# Altium project Ferrofluid_Display.PrjPcb
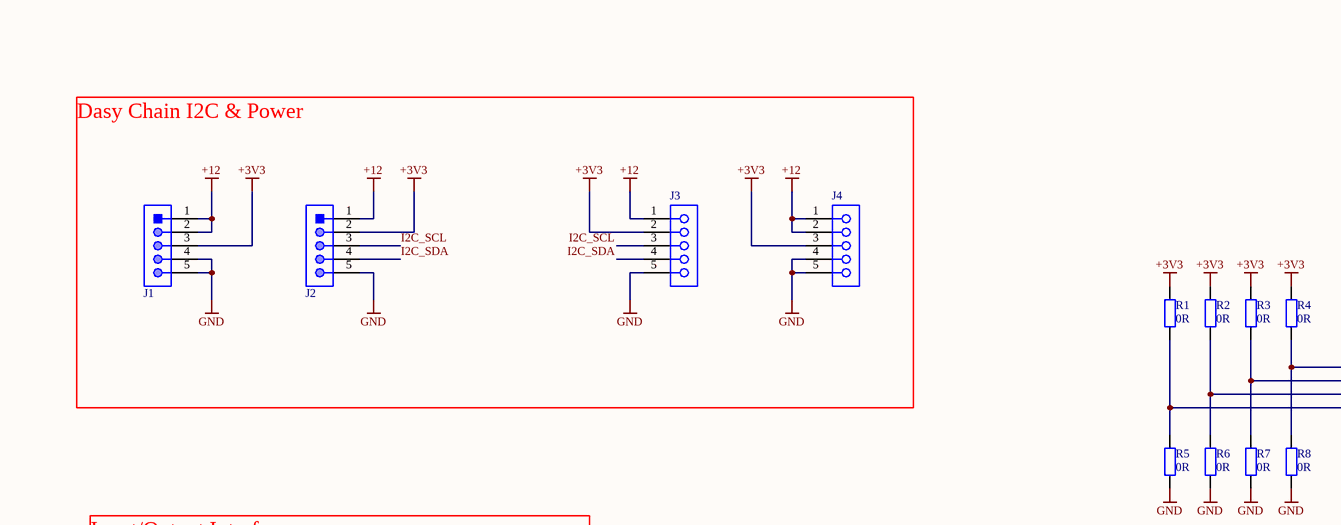
[diagram p0: Ferrofluid_Display.SchDoc, top left]
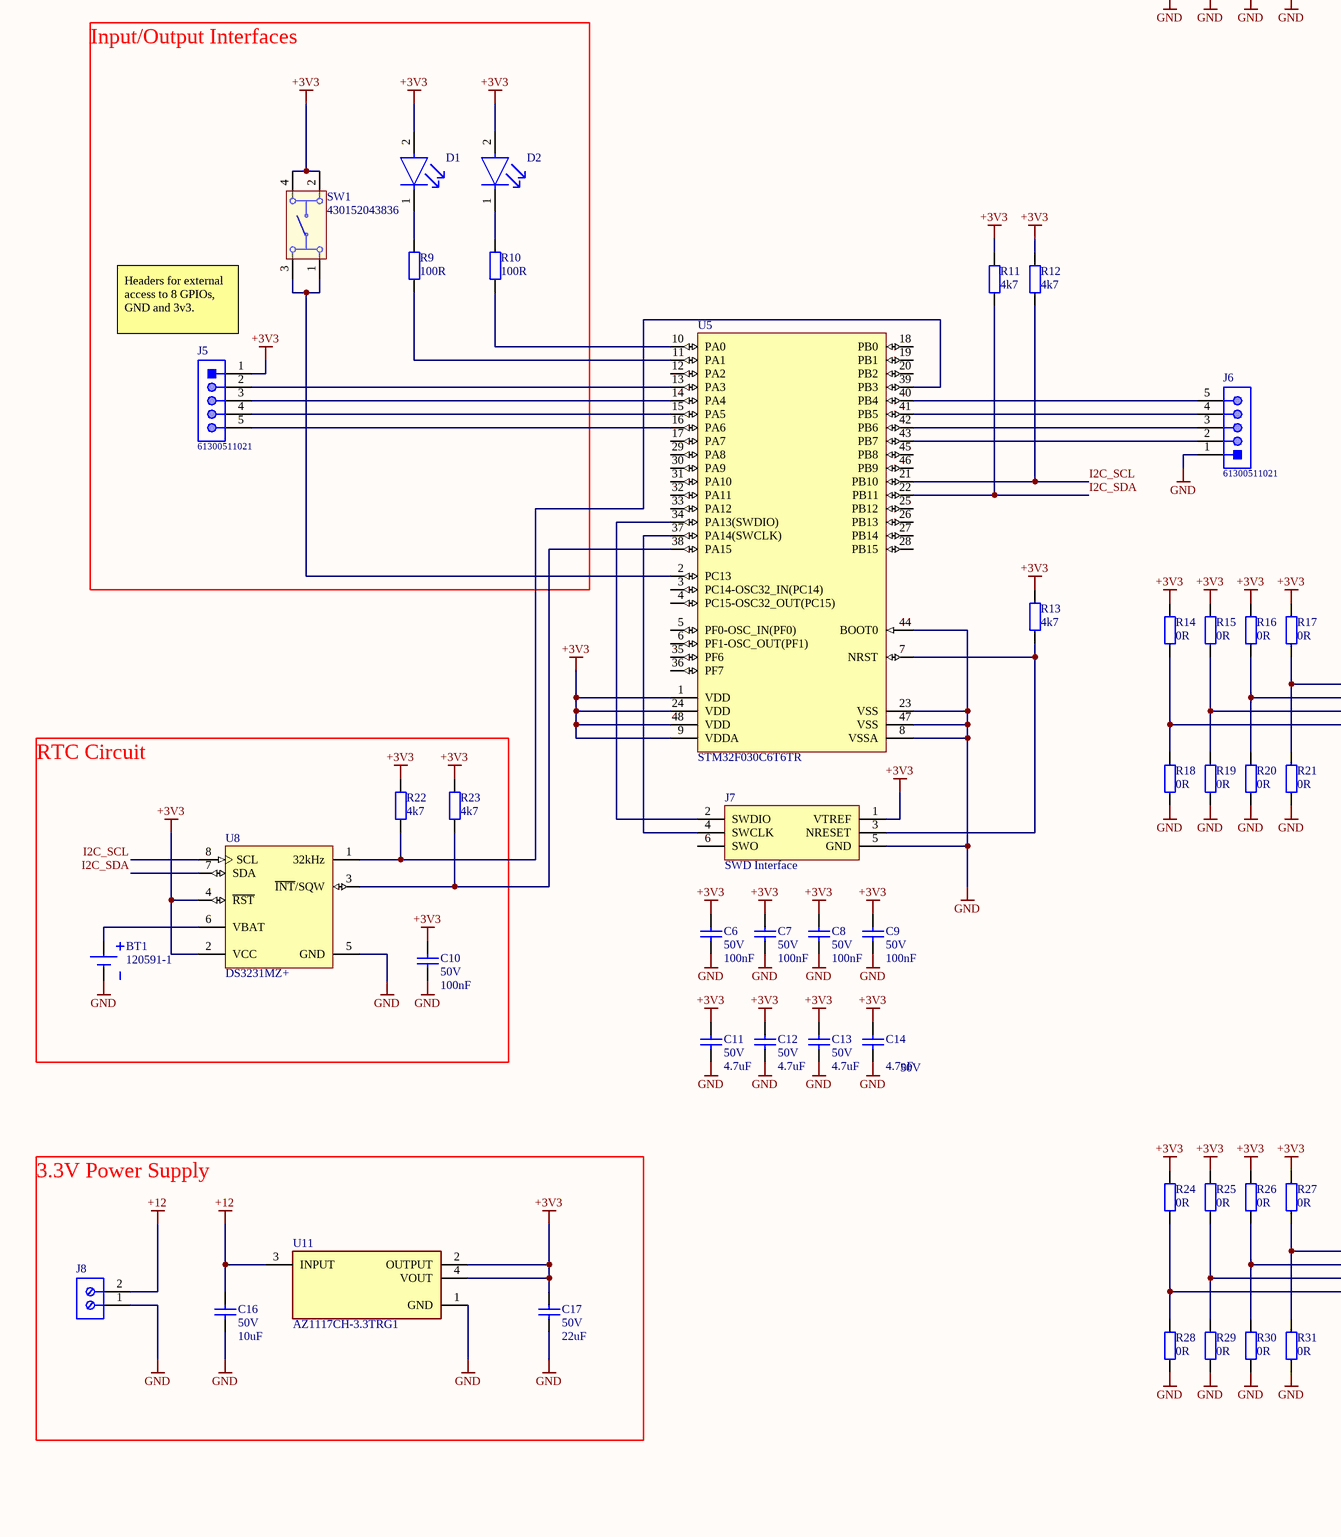
[diagram p1: Ferrofluid_Display.SchDoc, bottom left]
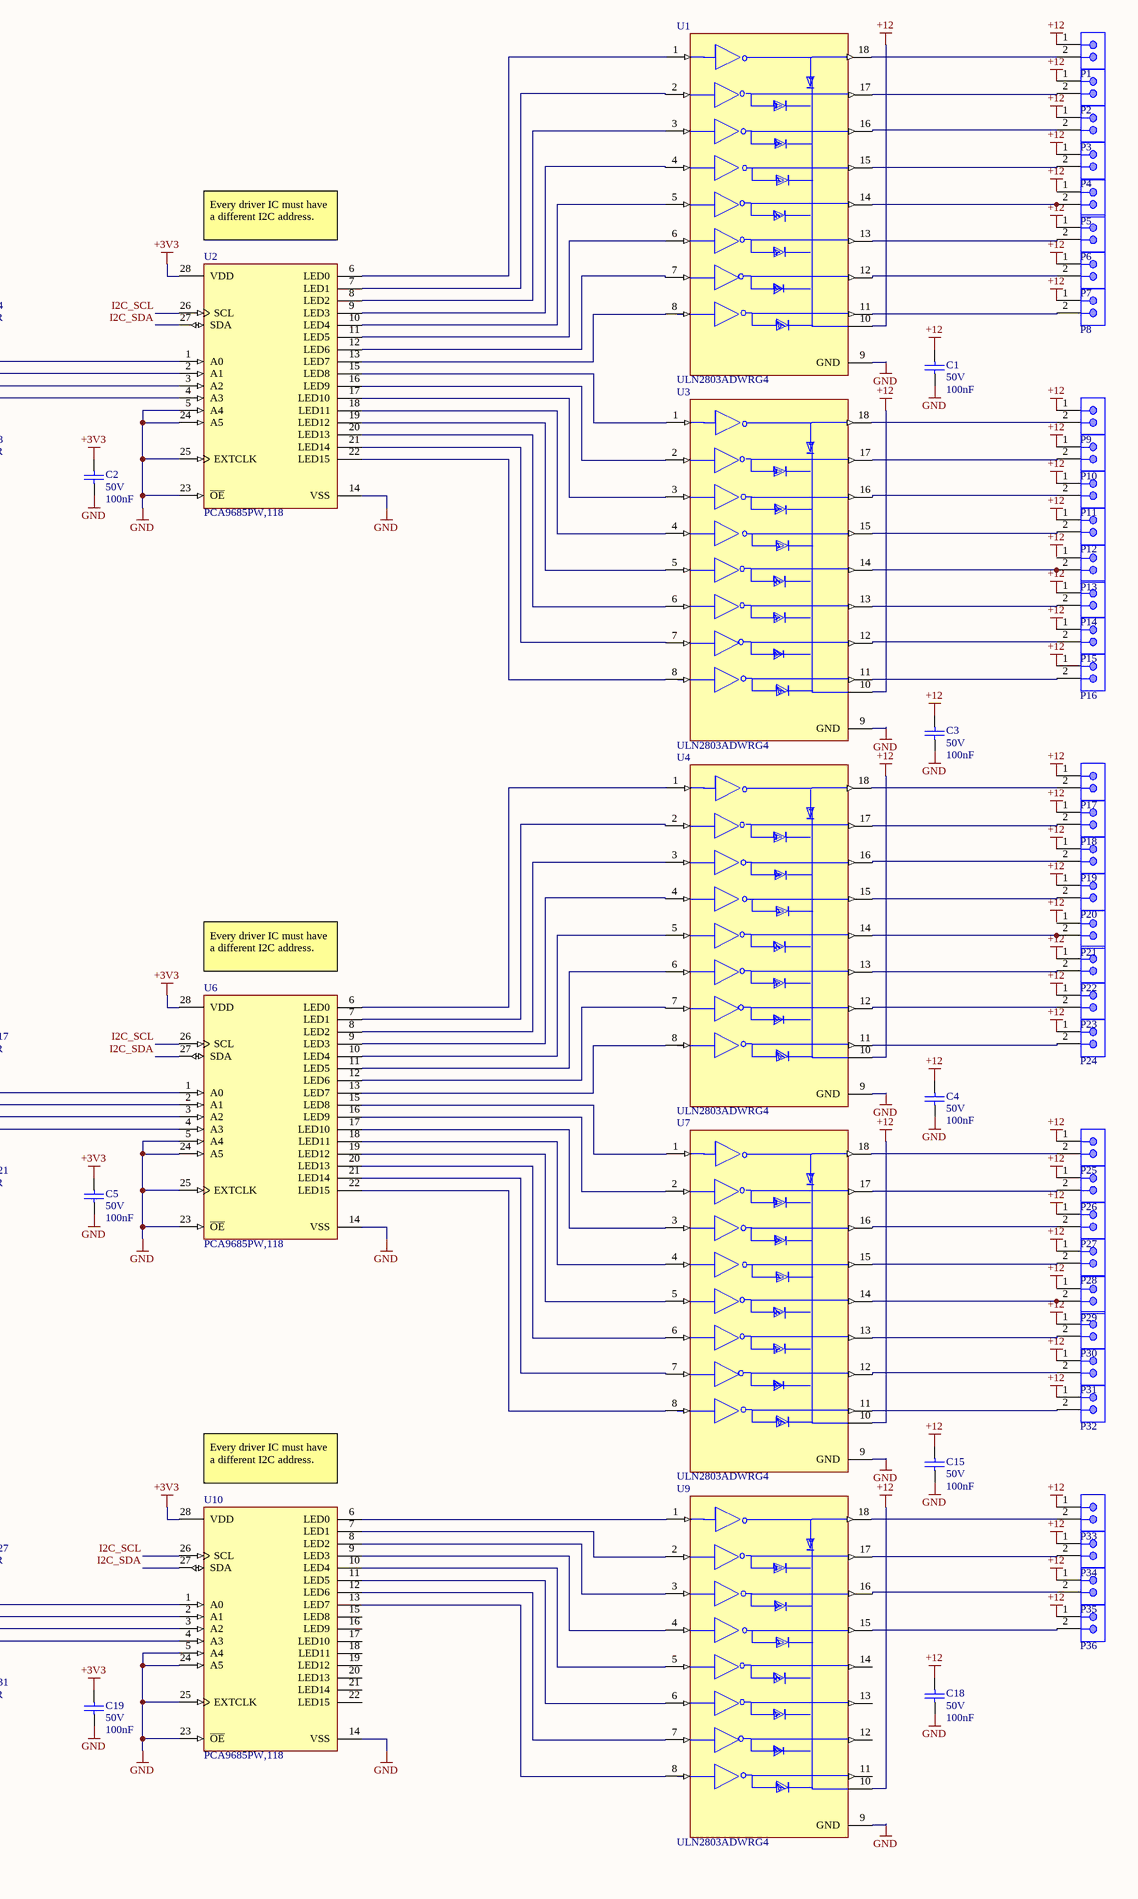
[diagram p2: Ferrofluid_Display.SchDoc, bottom right]
1 sheet, 109 parts. Net scope: global (net labels, ports and power ports of the same name join across sheets).
Board file: Ferrofluid_Display.PcbDoc

## Sheet Ferrofluid_Display.SchDoc
size A2

### Parts
BT1  120591-1  [TECO-120591-1-2_V]
C1  value 100nF  Voltage Rating: 50V  [CAPC2013X88X50ML20T25]  (hidden comment: Cap_0805)
C2  value 100nF  Voltage Rating: 50V  [CAPC2013X88X50ML20T25]  (hidden comment: Cap_0805)
C3  value 100nF  Voltage Rating: 50V  [CAPC2013X88X50ML20T25]  (hidden comment: Cap_0805)
C4  value 100nF  Voltage Rating: 50V  [CAPC2013X88X50ML20T25]  (hidden comment: Cap_0805)
C5  value 100nF  Voltage Rating: 50V  [CAPC2013X88X50ML20T25]  (hidden comment: Cap_0805)
C6  value 100nF  Voltage Rating: 50V  [CAPC2013X88X50ML20T25]  (hidden comment: Cap_0805)
C7  value 100nF  Voltage Rating: 50V  [CAPC2013X88X50ML20T25]  (hidden comment: Cap_0805)
C8  value 100nF  Voltage Rating: 50V  [CAPC2013X88X50ML20T25]  (hidden comment: Cap_0805)
C9  value 100nF  Voltage Rating: 50V  [CAPC2013X88X50ML20T25]  (hidden comment: Cap_0805)
C10  value 100nF  Voltage Rating: 50V  [CAPC2013X88X50ML20T25]  (hidden comment: Cap_0805)
C11  value 4.7uF  Voltage Rating: 50V  [CAPC2013X88X50ML20T25]  (hidden comment: Cap_0805)
C12  value 4.7uF  Voltage Rating: 50V  [CAPC2013X88X50ML20T25]  (hidden comment: Cap_0805)
C13  value 4.7uF  Voltage Rating: 50V  [CAPC2013X88X50ML20T25]  (hidden comment: Cap_0805)
C14  value 4.7uF  Voltage Rating: 50V  [CAPC2013X88X50ML20T25]  (hidden comment: Cap_0805)
C15  value 100nF  Voltage Rating: 50V  [CAPC2013X88X50ML20T25]  (hidden comment: Cap_0805)
C16  value 10uF  Voltage Rating: 50V  [CAPC2013X88X50ML20T25]  (hidden comment: Cap_0805)
C17  value 22uF  Voltage Rating: 50V  [CAPC2013X88X50ML20T25]  (hidden comment: Cap_0805)
C18  value 100nF  Voltage Rating: 50V  [CAPC2013X88X50ML20T25]  (hidden comment: Cap_0805)
C19  value 100nF  Voltage Rating: 50V  [CAPC2013X88X50ML20T25]  (hidden comment: Cap_0805)
D1  LTST-C150AKT  [FP-LTST-C150AKT-MFG]  (value not drawn)
D2  LTST-C150AKT  [FP-LTST-C150AKT-MFG]  (value not drawn)
J1  61300511021  [61300511021]  (value not drawn)
J2  61300511021  [61300511021]  (value not drawn)
J3  SSQ-105-02-T-S-RA  [SMTC-SSQ-105-02-X-S-RA]  (value not drawn)
J4  SSQ-105-02-T-S-RA  [SMTC-SSQ-105-02-X-S-RA]  (value not drawn)
J5  61300511021  [61300511021]
J6  61300511021  [61300511021]
J7  SWD Interface  [J-Link_6-pin_Needle_Adapter]
J8  691102710002  [691102710002]  (value not drawn)
P1  5-146280-2  [ELECTROMAGNET]  (value not drawn)
P2  5-146280-2  [ELECTROMAGNET]  (value not drawn)
P3  5-146280-2  [ELECTROMAGNET]  (value not drawn)
P4  5-146280-2  [ELECTROMAGNET]  (value not drawn)
P5  5-146280-2  [ELECTROMAGNET]  (value not drawn)
P6  5-146280-2  [ELECTROMAGNET]  (value not drawn)
P7  5-146280-2  [ELECTROMAGNET]  (value not drawn)
P8  5-146280-2  [ELECTROMAGNET]  (value not drawn)
P9  5-146280-2  [ELECTROMAGNET]  (value not drawn)
P10  5-146280-2  [ELECTROMAGNET]  (value not drawn)
P11  5-146280-2  [ELECTROMAGNET]  (value not drawn)
P12  5-146280-2  [ELECTROMAGNET]  (value not drawn)
P13  5-146280-2  [ELECTROMAGNET]  (value not drawn)
P14  5-146280-2  [ELECTROMAGNET]  (value not drawn)
P15  5-146280-2  [ELECTROMAGNET]  (value not drawn)
P16  5-146280-2  [ELECTROMAGNET]  (value not drawn)
P17  5-146280-2  [ELECTROMAGNET]  (value not drawn)
P18  5-146280-2  [ELECTROMAGNET]  (value not drawn)
P19  5-146280-2  [ELECTROMAGNET]  (value not drawn)
P20  5-146280-2  [ELECTROMAGNET]  (value not drawn)
P21  5-146280-2  [ELECTROMAGNET]  (value not drawn)
P22  5-146280-2  [ELECTROMAGNET]  (value not drawn)
P23  5-146280-2  [ELECTROMAGNET]  (value not drawn)
P24  5-146280-2  [ELECTROMAGNET]  (value not drawn)
P25  5-146280-2  [ELECTROMAGNET]  (value not drawn)
P26  5-146280-2  [ELECTROMAGNET]  (value not drawn)
P27  5-146280-2  [ELECTROMAGNET]  (value not drawn)
P28  5-146280-2  [ELECTROMAGNET]  (value not drawn)
P29  5-146280-2  [ELECTROMAGNET]  (value not drawn)
P30  5-146280-2  [ELECTROMAGNET]  (value not drawn)
P31  5-146280-2  [ELECTROMAGNET]  (value not drawn)
P32  5-146280-2  [ELECTROMAGNET]  (value not drawn)
P33  5-146280-2  [ELECTROMAGNET]  (value not drawn)
P34  5-146280-2  [ELECTROMAGNET]  (value not drawn)
P35  5-146280-2  [ELECTROMAGNET]  (value not drawn)
P36  5-146280-2  [ELECTROMAGNET]  (value not drawn)
R1  value 0R  [RESC2013X50X30ML20T20]  (hidden comment: Res_0805)
R2  value 0R  [RESC2013X50X30ML20T20]  (hidden comment: Res_0805)
R3  value 0R  [RESC2013X50X30ML20T20]  (hidden comment: Res_0805)
R4  value 0R  [RESC2013X50X30ML20T20]  (hidden comment: Res_0805)
R5  value 0R  [RESC2013X50X30ML20T20]  (hidden comment: Res_0805)
R6  value 0R  [RESC2013X50X30ML20T20]  (hidden comment: Res_0805)
R7  value 0R  [RESC2013X50X30ML20T20]  (hidden comment: Res_0805)
R8  value 0R  [RESC2013X50X30ML20T20]  (hidden comment: Res_0805)
R9  value 100R  [RESC2013X50X30ML20T20]  (hidden comment: Res_0805)
R10  value 100R  [RESC2013X50X30ML20T20]  (hidden comment: Res_0805)
R11  value 4k7  [RESC2013X50X30ML20T20]  (hidden comment: Res_0805)
R12  value 4k7  [RESC2013X50X30ML20T20]  (hidden comment: Res_0805)
R13  value 4k7  [RESC2013X50X30ML20T20]  (hidden comment: Res_0805)
R14  value 0R  [RESC2013X50X30ML20T20]  (hidden comment: Res_0805)
R15  value 0R  [RESC2013X50X30ML20T20]  (hidden comment: Res_0805)
R16  value 0R  [RESC2013X50X30ML20T20]  (hidden comment: Res_0805)
R17  value 0R  [RESC2013X50X30ML20T20]  (hidden comment: Res_0805)
R18  value 0R  [RESC2013X50X30ML20T20]  (hidden comment: Res_0805)
R19  value 0R  [RESC2013X50X30ML20T20]  (hidden comment: Res_0805)
R20  value 0R  [RESC2013X50X30ML20T20]  (hidden comment: Res_0805)
R21  value 0R  [RESC2013X50X30ML20T20]  (hidden comment: Res_0805)
R22  value 4k7  [RESC2013X50X30ML20T20]  (hidden comment: Res_0805)
R23  value 4k7  [RESC2013X50X30ML20T20]  (hidden comment: Res_0805)
R24  value 0R  [RESC2013X50X30ML20T20]  (hidden comment: Res_0805)
R25  value 0R  [RESC2013X50X30ML20T20]  (hidden comment: Res_0805)
R26  value 0R  [RESC2013X50X30ML20T20]  (hidden comment: Res_0805)
R27  value 0R  [RESC2013X50X30ML20T20]  (hidden comment: Res_0805)
R28  value 0R  [RESC2013X50X30ML20T20]  (hidden comment: Res_0805)
R29  value 0R  [RESC2013X50X30ML20T20]  (hidden comment: Res_0805)
R30  value 0R  [RESC2013X50X30ML20T20]  (hidden comment: Res_0805)
R31  value 0R  [RESC2013X50X30ML20T20]  (hidden comment: Res_0805)
SW1  430152043836  [430152043836]
U1  ULN2803ADWRG4  [FP-DW0018A-MFG]
U2  PCA9685PW,118  [FP-SOT361-1-MFG]
U3  ULN2803ADWRG4  [FP-DW0018A-MFG]
U4  ULN2803ADWRG4  [FP-DW0018A-MFG]
U5  STM32F030C6T6TR  [STM-LQFP48_M]
U6  PCA9685PW,118  [FP-SOT361-1-MFG]
U7  ULN2803ADWRG4  [FP-DW0018A-MFG]
U8  DS3231MZ+  [S8MK+1_N]
U9  ULN2803ADWRG4  [FP-DW0018A-MFG]
U10  PCA9685PW,118  [FP-SOT361-1-MFG]
U11  AZ1117CH-3.3TRG1  [FP-SOT223-MFG]

### Nets
+3V3: C2.2 C5.2 C6.2 C7.2 C8.2 C9.2 C10.2 C11.2 C12.2 C13.2 C14.2 C17.2 C19.2 D1.2(A) D2.2(A) J1.3 J2.2 J3.2 J4.3 J5.1 J7.1(VTREF) R1.2 R2.2 R3.2 R4.2 R11.2 R12.2 R13.2 R14.2 R15.2 R16.2 R17.2 R22.2 R23.2 R24.2 R25.2 R26.2 R27.2 SW1.2 SW1.4 U2.28(VDD) U5.1(VDD) U5.9(VDDA) U5.24(VDD) U5.48(VDD) U6.28(VDD) U8.2(VCC) U8.4(~{RST}) U10.28(VDD) U11.2(OUTPUT) U11.4(VOUT)
+12: C1.2 C3.2 C4.2 C15.2 C16.2 C18.2 J1.1 J1.2 J2.1 J3.1 J4.1 J4.2 J8.2 P1.1 P2.1 P3.1 P4.1 P6.1 P7.1 P8.1 P9.1 P10.1 P11.1 P12.1 P14.1 P15.1 P16.1 P17.1 P18.1 P19.1 P20.1 P22.1 P23.1 P24.1 P25.1 P26.1 P27.1 P28.1 P30.1 P31.1 P32.1 P33.1 P34.1 P35.1 P36.1 U1.10(COM) U3.10(COM) U4.10(COM) U7.10(COM) U9.10(COM) U11.3(INPUT)
GND: BT1.2(-) C1.1 C2.1 C3.1 C4.1 C5.1 C6.1 C7.1 C8.1 C9.1 C10.1 C11.1 C12.1 C13.1 C14.1 C15.1 C16.1 C17.1 C18.1 C19.1 J1.4 J1.5 J2.5 J3.5 J4.4 J4.5 J6.1 J7.5(GND) J8.1 R5.1 R6.1 R7.1 R8.1 R18.1 R19.1 R20.1 R21.1 R28.1 R29.1 R30.1 R31.1 U1.9(GND) U2.5(A4) U2.14(VSS) U2.23(~{OE}) U2.24(A5) U2.25(EXTCLK) U3.9(GND) U4.9(GND) U5.8(VSSA) U5.23(VSS) U5.44(BOOT0) U5.47(VSS) U6.5(A4) U6.14(VSS) U6.23(~{OE}) U6.24(A5) U6.25(EXTCLK) U7.9(GND) U8.5(GND) U9.9(GND) U10.5(A4) U10.14(VSS) U10.23(~{OE}) U10.24(A5) U10.25(EXTCLK) U11.1(GND)
I2C_SCL: J2.3 J3.3 R12.1 U2.26(SCL) U5.21(PB10) U6.26(SCL) U8.8(SCL) U10.26(SCL)
I2C_SDA: J2.4 J3.4 R11.1 U2.27(SDA) U5.22(PB11) U6.27(SDA) U8.7(SDA) U10.27(SDA)
NetBT1_1: BT1.1(+) U8.6(VBAT)
NetD1_1: D1.1(C) R9.2
NetD2_1: D2.1(C) R10.2
NetJ5_2: J5.2 U5.13(PA3)
NetJ5_3: J5.3 U5.14(PA4)
NetJ5_4: J5.4 U5.15(PA5)
NetJ5_5: J5.5 U5.16(PA6)
NetJ6_2: J6.2 U5.43(PB7)
NetJ6_3: J6.3 U5.42(PB6)
NetJ6_4: J6.4 U5.41(PB5)
NetJ6_5: J6.5 U5.40(PB4)
NetJ7_2: J7.2(SWDIO) U5.34(PA13(SWDIO))
NetJ7_3: J7.3(NRESET) R13.1 U5.7(NRST)
NetJ7_4: J7.4(SWCLK) U5.37(PA14(SWCLK))
NetP1_2: P1.2 U1.18(1C)
NetP2_2: P2.2 U1.17(2C)
NetP3_2: P3.2 U1.16(3C)
NetP4_2: P4.2 U1.15(4C)
NetP5_2: P5.2 U1.14(5C)
NetP6_2: P6.2 U1.13(6C)
NetP7_2: P7.2 U1.12(7C)
NetP8_2: P8.2 U1.11(8C)
NetP9_2: P9.2 U3.18(1C)
NetP10_2: P10.2 U3.17(2C)
NetP11_2: P11.2 U3.16(3C)
NetP12_2: P12.2 U3.15(4C)
NetP13_2: P13.2 U3.14(5C)
NetP14_2: P14.2 U3.13(6C)
NetP15_2: P15.2 U3.12(7C)
NetP16_2: P16.2 U3.11(8C)
NetP17_2: P17.2 U4.18(1C)
NetP18_2: P18.2 U4.17(2C)
NetP19_2: P19.2 U4.16(3C)
NetP20_2: P20.2 U4.15(4C)
NetP21_2: P21.2 U4.14(5C)
NetP22_2: P22.2 U4.13(6C)
NetP23_2: P23.2 U4.12(7C)
NetP24_2: P24.2 U4.11(8C)
NetP25_2: P25.2 U7.18(1C)
NetP26_2: P26.2 U7.17(2C)
NetP27_2: P27.2 U7.16(3C)
NetP28_2: P28.2 U7.15(4C)
NetP29_2: P29.2 U7.14(5C)
NetP30_2: P30.2 U7.13(6C)
NetP31_2: P31.2 U7.12(7C)
NetP32_2: P32.2 U7.11(8C)
NetP33_2: P33.2 U9.18(1C)
NetP34_2: P34.2 U9.17(2C)
NetP35_2: P35.2 U9.16(3C)
NetP36_2: P36.2 U9.15(4C)
NetR1_1: R1.1 R5.2 U2.4(A3)
NetR2_1: R2.1 R6.2 U2.3(A2)
NetR3_1: R3.1 R7.2 U2.2(A1)
NetR4_1: R4.1 R8.2 U2.1(A0)
NetR9_1: R9.1 U5.11(PA1)
NetR10_1: R10.1 U5.10(PA0)
NetR14_1: R14.1 R18.2 U6.4(A3)
NetR15_1: R15.1 R19.2 U6.3(A2)
NetR16_1: R16.1 R20.2 U6.2(A1)
NetR17_1: R17.1 R21.2 U6.1(A0)
NetR22_1: R22.1 U5.39(PB3) U8.1(32kHz)
NetR23_1: R23.1 U5.38(PA15) U8.3(~{INT}/SQW)
NetR24_1: R24.1 R28.2 U10.4(A3)
NetR25_1: R25.1 R29.2 U10.3(A2)
NetR26_1: R26.1 R30.2 U10.2(A1)
NetR27_1: R27.1 R31.2 U10.1(A0)
NetSW1_1: SW1.1 SW1.3 U5.2(PC13)
NetU1_1: U1.1(1B) U2.6(LED0)
NetU1_2: U1.2(2B) U2.7(LED1)
NetU1_3: U1.3(3B) U2.8(LED2)
NetU1_4: U1.4(4B) U2.9(LED3)
NetU1_5: U1.5(5B) U2.10(LED4)
NetU1_6: U1.6(6B) U2.11(LED5)
NetU1_7: U1.7(7B) U2.12(LED6)
NetU1_8: U1.8(8B) U2.13(LED7)
NetU2_15: U2.15(LED8) U3.1(1B)
NetU2_16: U2.16(LED9) U3.2(2B)
NetU2_17: U2.17(LED10) U3.3(3B)
NetU2_18: U2.18(LED11) U3.4(4B)
NetU2_19: U2.19(LED12) U3.5(5B)
NetU2_20: U2.20(LED13) U3.6(6B)
NetU2_21: U2.21(LED14) U3.7(7B)
NetU2_22: U2.22(LED15) U3.8(8B)
NetU4_1: U4.1(1B) U6.6(LED0)
NetU4_2: U4.2(2B) U6.7(LED1)
NetU4_3: U4.3(3B) U6.8(LED2)
NetU4_4: U4.4(4B) U6.9(LED3)
NetU4_5: U4.5(5B) U6.10(LED4)
NetU4_6: U4.6(6B) U6.11(LED5)
NetU4_7: U4.7(7B) U6.12(LED6)
NetU4_8: U4.8(8B) U6.13(LED7)
NetU6_15: U6.15(LED8) U7.1(1B)
NetU6_16: U6.16(LED9) U7.2(2B)
NetU6_17: U6.17(LED10) U7.3(3B)
NetU6_18: U6.18(LED11) U7.4(4B)
NetU6_19: U6.19(LED12) U7.5(5B)
NetU6_20: U6.20(LED13) U7.6(6B)
NetU6_21: U6.21(LED14) U7.7(7B)
NetU6_22: U6.22(LED15) U7.8(8B)
NetU9_1: U9.1(1B) U10.6(LED0)
NetU9_2: U9.2(2B) U10.7(LED1)
NetU9_3: U9.3(3B) U10.8(LED2)
NetU9_4: U9.4(4B) U10.9(LED3)
NetU9_5: U9.5(5B) U10.10(LED4)
NetU9_6: U9.6(6B) U10.11(LED5)
NetU9_7: U9.7(7B) U10.12(LED6)
NetU9_8: U9.8(8B) U10.13(LED7)

Not connected (* = marked no-connect by the designer): J7 6(SWO); P5 1; P13 1; P21 1; P29 1; U5 3(PC14-OSC32_IN(PC14)) 4(PC15-OSC32_OUT(PC15)) 5(PF0-OSC_IN(PF0)) 6(PF1-OSC_OUT(PF1)) 12(PA2) 17(PA7) 18(PB0) 19(PB1) 20(PB2) 25(PB12) 26(PB13) 27(PB14) 28(PB15) 29(PA8) 30(PA9) 31(PA10) 32(PA11) 33(PA12) 35(PF6) 36(PF7) 45(PB8) 46(PB9); U9 11(8C) 12(7C) 13(6C) 14(5C); U10 15(LED8) 16(LED9) 17(LED10) 18(LED11) 19(LED12) 20(LED13) 21(LED14) 22(LED15)

### Notes on the sheet
- (near U2) Every driver IC must have a different I2C address.
- Dasy Chain I2C & Power
- Headers for external access to 8 GPIOs, GND and 3v3.
- Input/Output Interfaces
- (near U6) Every driver IC must have a different I2C address.
- RTC Circuit
- (near U10) Every driver IC must have a different I2C address.
- 3.3V Power Supply
- Labels drawn without touching a wire or pin: +12
- Artikelname:
- Biral AG
- CH 3110 Münsingen
- Format:
- Artikelnummer:
- Gezeichnet:
- Geprüft:
- Blatt:
- A2
- of
- Zeichnungsnummer:
- Index:

### Library data of the parts
BT1 = CMP-0438-00001-2: Lithium Battery Holder for CR2032 3V Cell; Manufacturer: TE Connectivity; Packing Type: Tray; Body Shape: Horizontal Cylindrical; AccessRights: 2147483647; RevisionId: 1; Folder: Unified Components\Components\TE Connectivity\Connectors & Connector Components\Power Products\Battery Interconnection Products\; ContentType: Unified Component; ContentTypeGUID: CB3C11C4-E317-11DF-B822-12313F0024A2; ComponentLink1Description: Manufacturer URL; LifeCycleStateGUID: 61E382EE-6656-4F12-9E24-BE9327104A25; FolderGUID: A6761B51-D489-48A3-9180-F4808F45AB79; PartNumber: 120591-1; LifeCycle: Released; ReleaseDate: 20/08/2013 02:50:22 AM; PackageReference: 120591-1; ComponentLink2URL: http://www.te.com/commerce/DocumentDelivery/DDEController?Action=showdoc&DocId=Customer+Drawing%7F120591%7FH%7Fpdf%7FEnglish%7FENG_CD_120591_H.pdf%7F120591-1; DatasheetVersion: Rev. H, 01/2013; PackageDescription: Lithium Battery Holder; ItemGUID: B2C50140-681E-4F62-8DBB-9728605318CE; ItemHRID: CMP-0438-00001; Mounting Technology: Through Hole; ComponentLink1URL: http://www.te.com/; ComponentLink2Description: Datasheet
C1-C19 = Cap_0805: Ceramic Capacitor X7R
D1 D2 = CMP-22017-000004-1: LED AMBER CLEAR SMD; Manufacturer: Lite-On; Luminous Intensity: 6mcd; Viewing Angle: 130°; Wavelength: 602nm; Reverse Voltage: 5V; Forward Current: 30mA; Led Orientation: Top View; Power Dissipation: 100mW; Peak Emmision Wavelength: 610nm; Forward Voltage: 2.1V; ComponentLink2Description: Datasheet; Device Class L3: unset; Height: 1.2mm; RoHS: TRUE; ComponentLink2URL: https://media.digikey.com/pdf/Data%20Sheets/Lite-On%20PDFs/LTST-C150AKT.pdf; Temperature: -55°C to +85°C; Package: 0; Automotive: No; Manufacturer Part Number: LTST-C150AKT; Temperature Range Low: -55°C; Device Class L2: LEDs; Device Class L1: Optoelectronics; Octopart: https://octopart.com/ltst-c150akt-lite-on-549804; Digikey Description: LED AMBER CLEAR SMD; Colour: Amber; Category: Diode; Mouser Description: Standard LEDs - SMD Amber Clear 602nm; Lead Free: Yes; Temperature Range High: +85°C
J1 J2 J5 J6 = CMP-1502-01067-1: THT Angled Pin Header WR-PHD, Pitch 2.54 mm, Single Row, 5 pins; Manufacturer: Wurth Elektronik; Working Voltage: 250VAC; Withstanding Voltage: 500VAC; Gender: Male; Contact Resistance: 20mOhm; Rated Current: 3A; Pitch: 2.54mm; Pin Number: 5; Orientation: Angled; Packaging: Bag; Package Reference: 61300511021; Mounting Technology: THT; Publisher: WurthElektronik; Row Number: Single; Operating Temperature: -40to105degC; Part Number: 61300511021; Datasheet URL: https://katalog.we-online.de/em/datasheet/6130xx11021.pdf; Manufacturer URL: http://www.we-online.de
J3 J4 = CMP-1023-00281-1: SQ Post Socket, Through-hole, Right Angle, -55 to 105 degC, 2.54 mm Pitch, 5-Pin, Female, RoHS; Manufacturer: Samtec; Pitch: 2.54 mm; ComponentLink1URL: http://www.samtec.com; ComponentLink2Description: Datasheet; ComponentLink3URL: http://www.samtec.com/documents/webfiles/cpdf/SSQ-1XX-XX-XXX-X-XX-XXX-XX-X-MKT.pdf; DatasheetVersion: F-214; ComponentLink1Description: Manufacturer URL; Mounting Technology: Through-hole; ComponentLink2URL: http://www.samtec.com/documents/webfiles/pdf/SSQ_TH.PDF; PackageVersion: BD, 6/1987; ComponentLink3Description: Package Specification; RoHS: True; PackageReference: SSQ-105-02-X-S-RA; Orientation: Right Angle; PartNumber: SSQ-105-02-T-S-RA; Temperature Range: -55 to 105 degC; PackageDescription: Assembly, Socket Strip .025[0.64] SQ Tail
J7 = J-Link_6-pin_Needle_Adapter: J-Link 6-pin Needle Adapter
J8 = CMP-1502-03258-1: Series 102 - 5.00 mm Horizontal Entry Modular with Pressure Clamp WR-TBL, 2 pin; Manufacturer: Wurth Elektronik; Pin Number: 2; Pitch: 5.00mm; Manufacturer URL: http://www.we-online.de; Mounting Technology: THT; Publisher: WurthElektronik; Packaging: Box; Package Reference: 691102710002; Datasheet URL: http://katalog.we-online.de/em/datasheet/6911027100xx.pdf; Operating Temperature: -40to105degC; Part Number: 691102710002
P1-P36 = Magnet: Male Header, Pitch 2.54 mm, 1 x 2 Position, Height 8.21 mm, Tail Length 3.05 mm, -65 to 105 degC, RoHS, Bulk; Manufacturer: TE Connectivity; Mating Connector Lock: No(Without); Number of Positions: 2; Pitch: 2.54mm; PCB Mounting Orientation: Vertical; Keyed: No; Case\/Package: 100; Mating Post Length: 0.23inch; High Temperature Housing: Yes; Max Current Rating: 5A; PCB Thickness: 0.063inch; PCB Mount Retention: Without; Approvals: CSA; Current Rating: 3A; Radiation Hardening: No; Length: 4.67mm; Contact Mating Length: 0.23inch; Connector Type: Header; Number of Rows: 1; Termination Post Length: 0.12inch; Board Standoff: No(Without); Max Operating Temperature: 105degC; Contact Shape: Square; Selectively Loaded: No(Without); Gasket: No(Without); Number of Contacts: 2; Contact Gender: Male; Mating Alignment: No(Without); Manufacturer URL: http://www.te.com/; Datasheet URL: http://www.te.com/commerce/DocumentDelivery/DDEController?Action=showdoc&DocId=Customer+Drawing%7F146280%7FH1%7Fpdf%7FEnglish%7FENG_CD_146280_H1.pdf%7F5-146280-2; Mount: ThroughHole; Orientation: Straight; Packaging: Carton; Package Reference: 5-146280-2; Package Quantity: 500; Stabilizers: No(Without); Row Spacing: 2.54mm; Contact Material: CopperAlloy; Panel Mount Retention: No(Without); Datasheet Version: Rev. H1, 08/2016; Housing Colour: Black; Colour: Black; Package Description: Male Header, Pitch 2.54 mm, 1 x 2 Position, Height 8.21 mm, Tail Length 3.05 mm; Contact Plating: Matte; Housing Material: Polymer; Contact Protection: No(Without); Min Operating Temperature: -65degC; Mounting Technology: ThroughHole; Flammability Rating: UL94V-0; RoHSCompliant: true; Termination: ThroughHole; Depth: 2.34mm; High Speed Serial Data Connector: No
R1-R31 = Res_0805: Resistor; Tolerance: 1%; Power Rating: 125mW
SW1 = CMP-1452-00002-1: WS-TASV SMD Tact Switch 6X6 mm; Manufacturer: Wuerth Elektronik; NoPins: 04; PartNumber: 430152043836; ComponentLink2URL: http://katalog.we-online.de/em/datasheet/4301x2.pdf; ComponentLink1URL: http://www.we-online.com; ComponentLink2Description: Datasheet; ComponentLink1Description: Manufacturer URL; PackageReference: 430152043836
U1 U3 U4 U7 U9 = CMP-04912-000023-1: TRANS 8NPN DARL 50V 0.5A 18SO; Manufacturer: Texas Instruments; Number Of Drivers: 8; Max Junction Temp: +150°C; Standoff Height: 0.1mm; Turn On Delay Time: 20ns; Nominal Supply Current: 0.93mA; Turn Off Delay Time: 130ns; Output Current: 500mA; Manufacturer Part Number: ULN2803ADWRG4; Mouser Description: Darlington Transistors TRANSISTOR ARRAYS; Temperature Range High: +85°C; Ipc Land Pattern Name: SOIC127P1030X265-18; RoHS: TRUE; ComponentLink2URL: http://www.ti.com/lit/ds/symlink/uln2803a.pdf; Device Class L2: Power Management ICs; Output Voltage: 50V; Digikey Description: TRANS 8NPN DARL 50V 0.5A 18SO; Package: DW0018A; Device Class L3: Gate Drivers; Octopart: https://octopart.com/uln2803adwrg4-texas+instruments-2343640; ComponentLink2Description: Datasheet; Ambient Temperature Range High: +85°C; Lead Free: Yes; Device Class L1: Integrated Circuits (ICs); Height: 2.65mm; Category: IC; Automotive: No; Temperature: -40°C to +85°C; Temperature Range Low: -40°C; Ambient Temperature Range Low: -40°C; Number Of Outputs: 8
U2 U6 U10 = CMP-10140-000001-1: IC LED DRIVER RGBA 28-TSSOP; Manufacturer: NXP Semiconductors; Max Power Dissipation: 400mW; Dimming: I2C,PWM; Number Of Outputs: 16; Import Ts: 1521846855; Min Supply Voltage: 2.3V; Max Supply Voltage: 5.5V; Output Voltage: 5V; Nominal Supply Current: 6mA; Standoff Height: 0.05mm; Output Current: 25mA; Ciiva Ids: 1426473; Temperature Range Low: -40°C; Footprint Url: https://www.nxp.com/docs/en/package-information/SOT361-1.pdf; Height: 1.1mm; Manufacturer Part Number: PCA9685PW,118; Device Class L2: Power Management ICs; Temperature: -40°C to +85°C; Temperature Range High: +85°C; Digikey Description: IC LED DRIVER RGBA 28-TSSOP; ComponentLink2Description: Datasheet; Device Class L3: LED Drivers; Ambient Temperature Range Low: -40°C; ComponentLink2URL: https://www.nxp.com/docs/en/data-sheet/PCA9685.pdf; Ambient Temperature Range High: +85°C; Device Class L1: Integrated Circuits (ICs); Mouser Description: LED Display Drivers I2C Bus LED Controller 28-Pin; Octopart: https://octopart.com/pca9685pw%2C118-nxp+semiconductors-11853435; Release Date: 1454319143; Lead Free: Yes; Category: IC; RoHS: TRUE; Package: SOT361-1; Automotive: No
U5 = CMP-0304-00063-2: ARM Cortex-M0 32-bit MCU, 32 KB Flash, 4 KB Internal RAM, 39 I/Os, 48-Pin LQFP, -40 to 85 degC, Tape and Reel; Manufacturer: STMicroelectronics; I/Os (High Current): 39; FLASH Size (Prog) (kB): 32; Operating Frequency(F) (Processor speed) (MHz): 48; Supply Voltage(Vcc) min (V): 2.4; Internal RAM Size (kB): 4; Package Description: 48-Pin Low Profile Quad Flat Package, Body 7 x 7 mm, Pitch 0.5 mm; DatasheetVersion: Rev. 2; ComponentLink1URL: http://www.st.com/; ComponentLink2URL: http://www.st.com/st-web-ui/static/active/en/resource/technical/document/datasheet/DM00088500.pdf; Mounting Technology: Surface Mount; Core: ARM Cortex-M0; Package Reference: LQFP48; Packing: Tape and Reel; PartNumber: STM32F030C6T6TR; ComponentLink2Description: Datasheet; ComponentLink1Description: Manufacturer URL
U8 = CMP-0254-00001-2: +/-5ppm, MEMS based Real-Time Clock, I2C Interface, 8-Pin SO, -40 to 85 degC, Pb-Free; PackageVersion: revC, 2010; ComponentLink3Description: Package Specification; ComponentLink3URL: http://pdfserv.maxim-ic.com/package_dwgs/21-0041.PDF; PackageReference: S8MK+1; DatasheetVersion: Rev 3, Dec-2011; ComponentLink1Description: Manufacturer URL; ComponentLink2Description: Datasheet; PackageDescription: 8-Pin Small-Outline IC, Narrow (0.15in), 1.27 mm Pitch, SOIC (N), Pb-Free; Code_IPC: SOIC127P600-8; ComponentLink1URL: http://www.maxim-ic.com; Code_JEDEC: MS-012-AA; ComponentLink2URL: http://datasheets.maxim-ic.com/en/ds/DS3231M.pdf
U11 = CMP-12756-000028-1: IC REG LINEAR 3.3V 800MA SOT223; Accuracy: 1%; Reference Voltage: 1.262V; Quiescent Current: 6mA; Power Supply Rejection Ratio (PSRR): 70dB; Max Input Voltage: 15V; Max Output Current: 1.35A; Output Type: Fixed; Min Current Limit: 1A; Number of Regulators: 1; Polarity: Positive; Dropout Voltage: 1.2V; Output Current: 800mA; Width: 3.7mm; Case/Package: SOT-223; Length: 6.7mm; Mount: Surface Mount; Output Voltage: 3.3V; Lead Free: Lead Free; Min Operating Temperature: -20°C; Packaging: Tape and Reel; Package Quantity: 4000; Max Operating Temperature: 125°C; Number of Pins: 4; Number of Outputs: 1; Height: 1.7mm